# Altium schematic sheet MCU.SchDoc
size A3
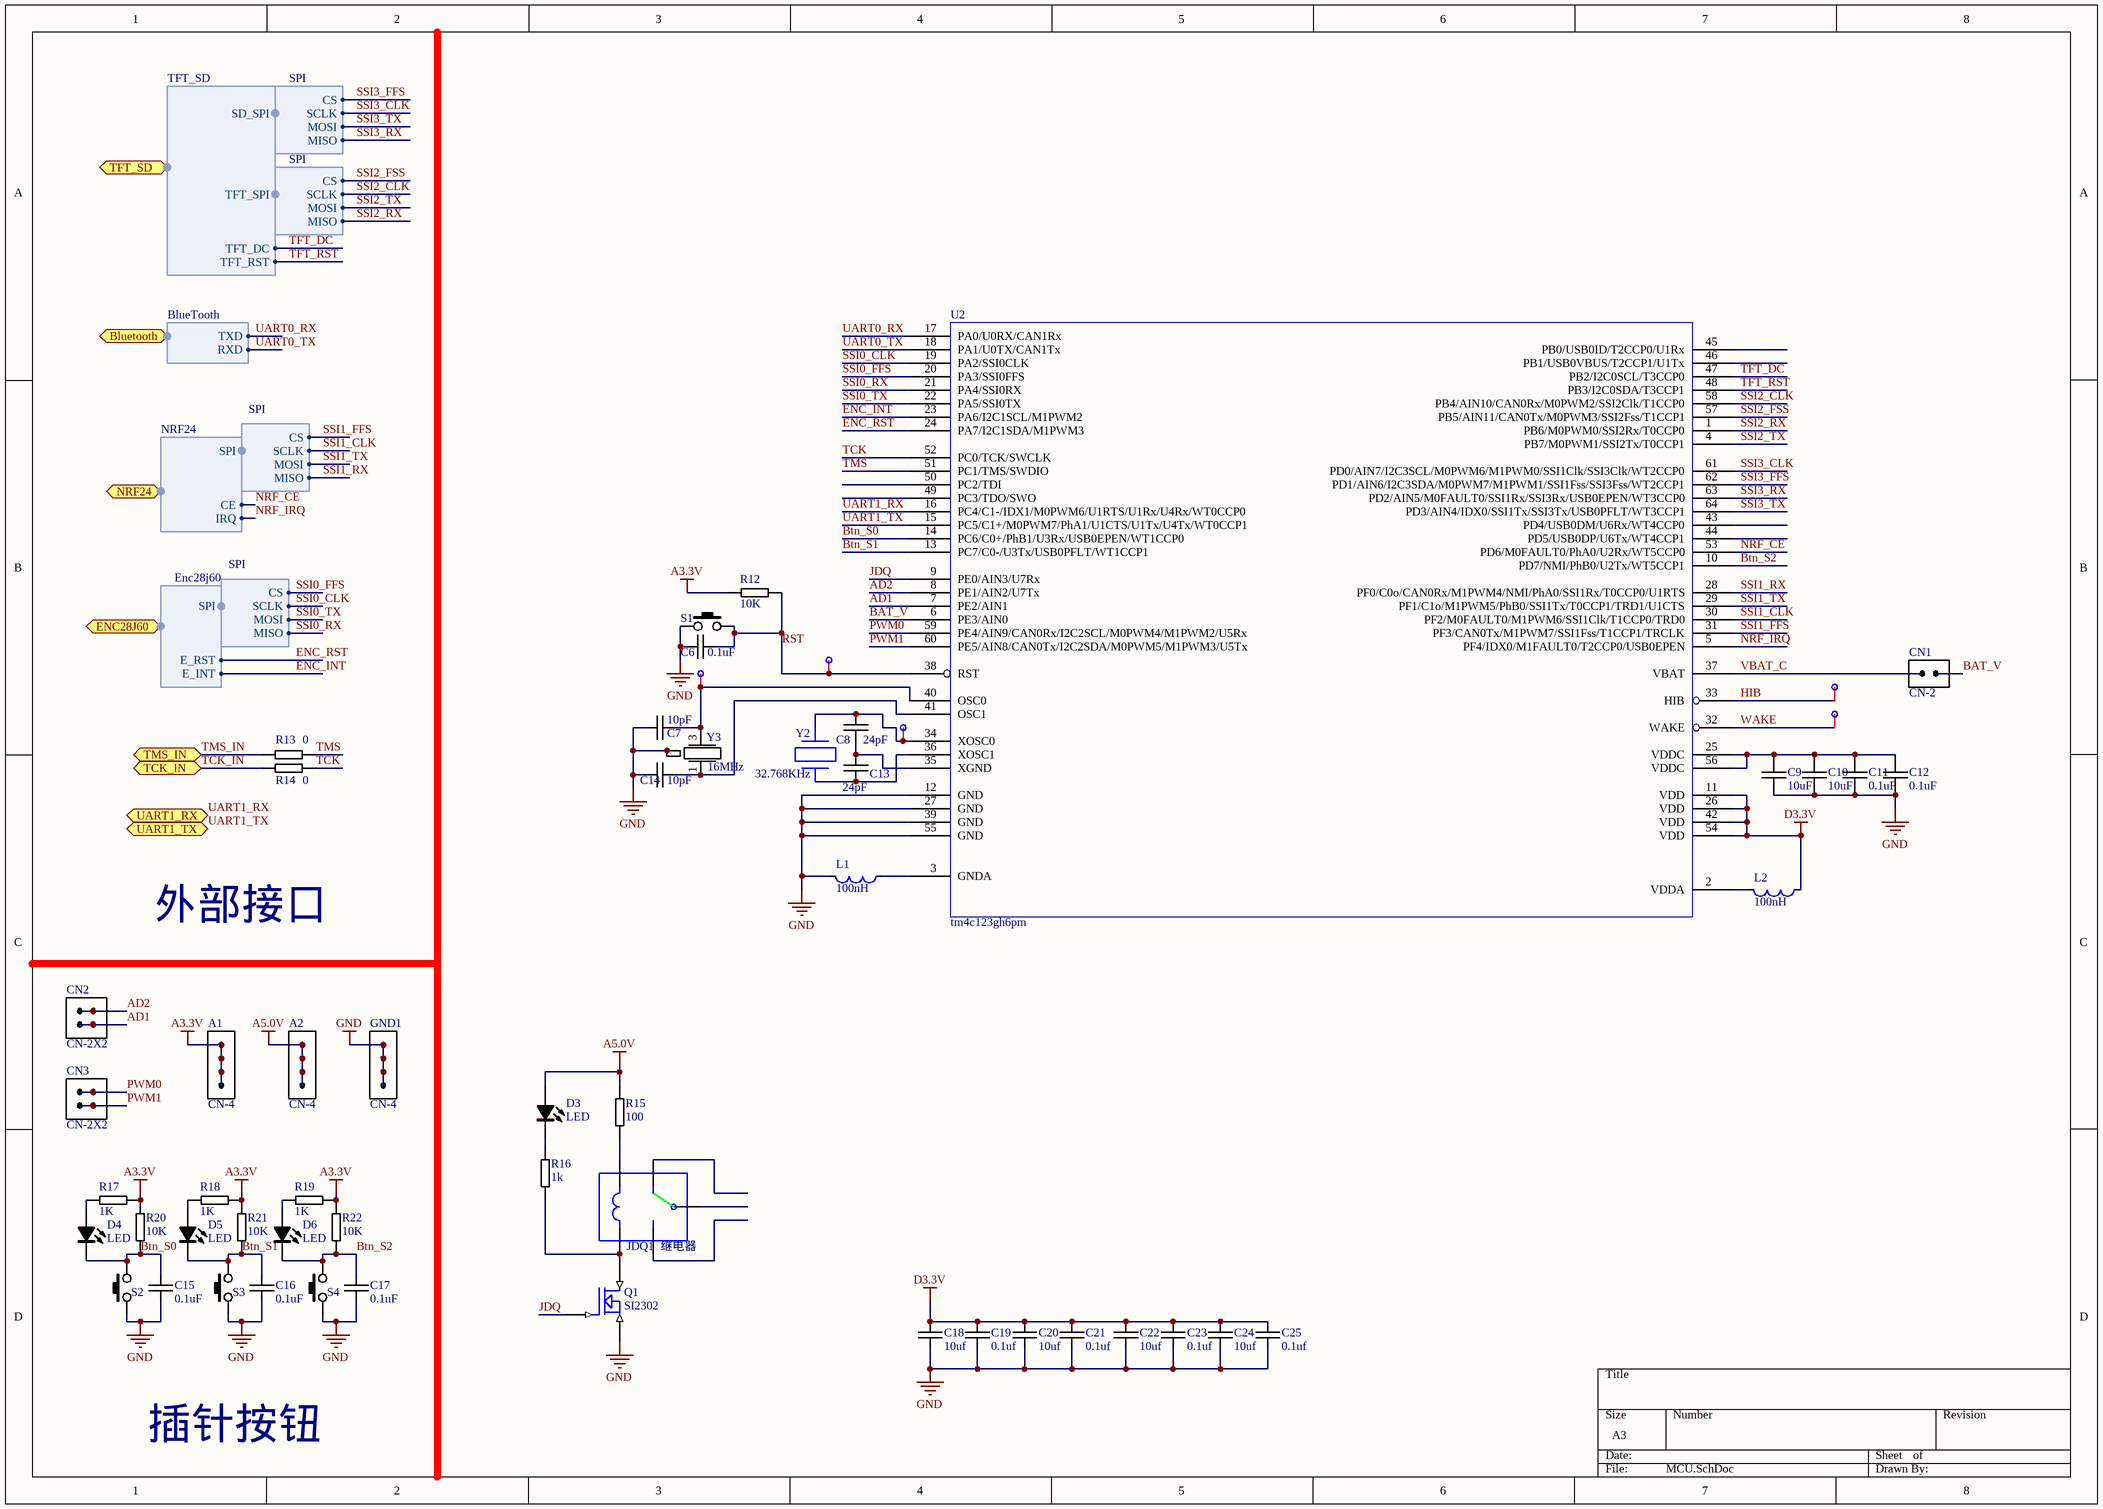
[diagram p0: MCU.SchDoc]

## Parts
A1  CN-4  [SIP-4]
A2  CN-4  [SIP-4]
C6  0.1uF  [0805-C]
C7  10pF  [0805-C]
C8  24pF  [0805-C]
C9  10uF  [0805-C]
C10  10uF  [0805-C]
C11  0.1uF  [0805-C]
C12  0.1uF  [0805-C]
C13  24pF  [0805-C]
C14  10pF  [0805-C]
C15  0.1uF  [0805-C]
C16  0.1uF  [0805-C]
C17  0.1uF  [0805-C]
C18  10uf  [0603]
C19  0.1uf  [0603]
C20  10uf  [0603]
C21  0.1uf  [0603]
C22  10uf  [0603]
C23  0.1uf  [0603]
C24  10uf  [0603]
C25  0.1uf  [0603]
CN1  CN-2  [SIP-2]
CN2  CN-2X2  [IDC-4]
CN3  CN-2X2  [IDC-4]
D3  LED  [0805-LED]
D4  LED  [0805-LED]
D5  LED  [0805-LED]
D6  LED  [0805-LED]
GND1  CN-4  [SIP-4]
JDQ1  继电器  [继电器]
L1  100nH  [0805]
L2  100nH  [0805]
P2  Point  [Point]  (value not drawn)
P3  Point  [Point]  (value not drawn)
P4  Point  [Point]  (value not drawn)
P5  Point  [Point]  (value not drawn)
P6  Point  [Point]  (value not drawn)
Q1  SI2302  [sot-23]
R12  10K  [0805-R]
R13  0  [0603]
R14  0  [0603]
R15  100  [0603]
R16  1k  [0805-R]
R17  1K  [0805-R]
R18  1K  [0805-R]
R19  1K  [0805-R]
R20  10K  [0805-R]
R21  10K  [0805-R]
R22  10K  [0805-R]
S1  KEY(轻触,6×6×4.3)  [轻触开关(3*6*2.5)]  (value not drawn)
S2  KEY(轻触,6×6×4.3)  [轻触开关(3*6*2.5)]  (value not drawn)
S3  KEY(轻触,6×6×4.3)  [轻触开关(3*6*2.5)]  (value not drawn)
S4  KEY(轻触,6×6×4.3)  [轻触开关(3*6*2.5)]  (value not drawn)
U2  tm4c123gh6pm  [LQFP64]
Y2  32.768KHz  [XTAL(Φ2×6)]
Y3  16MHz  [4脚晶振]

## Ports
Bluetooth (harness BlueTooth), ENC28J60 (harness Enc28j60), NRF24 (harness NRF24), TCK_IN, TFT_SD (harness TFT_SD), TMS_IN, UART1_RX, UART1_TX

## Harnesses
Enc28j60: SPI, E_RST, E_INT
SPI: CS, SCLK, MOSI, MISO
NRF24: SPI, CE, IRQ
BlueTooth: TXD, RXD
TFT_SD: SD_SPI, TFT_SPI, TFT_DC, TFT_RST

## Nets
A3.3V: A1.1 A1.2 A1.3 A1.4 R12.2 R17.2 R18.2 R19.2 R20.1 R21.1 R22.1
A5.0V: A2.1 A2.2 A2.3 A2.4 D3.1(A) R15.1
D3.3V: C18.1 C19.1 C20.1 C21.1 C22.1 C23.1 C24.1 C25.1 L2.2 U2.11(VDD) U2.26(VDD) U2.42(VDD) U2.54(VDD)
GND: C6.1 C7.1 C9.2 C10.2 C11.2 C12.2 C14.1 C15.1 C16.1 C17.1 C18.2 C19.2 C20.2 C21.2 C22.2 C23.2 C24.2 C25.2 GND1.1 GND1.2 GND1.3 GND1.4 L1.1 Q1.2(S) S1.1 S2.1 S3.1 S4.1 U2.12(GND) U2.27(GND) U2.39(GND) U2.55(GND) Y3.2(G) Y3.4(G)
AD1: CN2.3 CN2.4 U2.7(PE2/AIN1)
AD2: CN2.1 CN2.2 U2.8(PE1/AIN2/U7Tx)
BAT_V: CN1.2 U2.6(PE3/AIN0)
Btn_S0: C15.2 D4.2(K) R20.2 S2.2 U2.14(PC6/C0+/PhB1/U3Rx/USB0EPEN/WT1CCP0)
Btn_S1: C16.2 D5.2(K) R21.2 S3.2 U2.13(PC7/C0-/U3Tx/USB0PFLT/WT1CCP1)
Btn_S2: C17.2 D6.2(K) R22.2 S4.2 U2.10(PD7/NMI/PhB0/U2Tx/WT5CCP1)
ENC_INT: U2.23(PA6/I2C1SCL/M1PWM2) ; port ENC28J60.E_INT
ENC_RST: U2.24(PA7/I2C1SDA/M1PWM3) ; port ENC28J60.E_RST
HIB: P4.1(Point) U2.33(HIB)
JDQ: Q1.1(G) U2.9(PE0/AIN3/U7Rx)
NRF_CE: U2.53(PD6/M0FAULT0/PhA0/U2Rx/WT5CCP0) ; port NRF24.CE
NRF_IRQ: U2.5(PF4/IDX0/M1FAULT0/T2CCP0/USB0EPEN) ; port NRF24.IRQ
PWM0: CN3.1 CN3.2 U2.59(PE4/AIN9/CAN0Rx/I2C2SCL/M0PWM4/M1PWM2/U5Rx)
PWM1: CN3.3 CN3.4 U2.60(PE5/AIN8/CAN0Tx/I2C2SDA/M0PWM5/M1PWM3/U5Tx)
RST: C6.2 P2.1(Point) R12.1 S1.2 U2.38(RST)
SSI0_CLK: U2.19(PA2/SSI0CLK) ; harness SPI.SCLK
SSI0_FFS: U2.20(PA3/SSI0FFS) ; harness SPI.CS
SSI0_RX: U2.21(PA4/SSI0RX) ; harness SPI.MISO
SSI0_TX: U2.22(PA5/SSI0TX) ; harness SPI.MOSI
SSI1_CLK: U2.30(PF2/M0FAULT0/M1PWM6/SSI1Clk/T1CCP0/TRD0) ; harness SPI.SCLK
SSI1_FFS: U2.31(PF3/CAN0Tx/M1PWM7/SSI1Fss/T1CCP1/TRCLK) ; harness SPI.CS
SSI1_RX: U2.28(PF0/C0o/CAN0Rx/M1PWM4/NMI/PhA0/SSI1Rx/T0CCP0/U1RTS) ; harness SPI.MISO
SSI1_TX: U2.29(PF1/C1o/M1PWM5/PhB0/SSI1Tx/T0CCP1/TRD1/U1CTS) ; harness SPI.MOSI
SSI2_CLK: U2.58(PB4/AIN10/CAN0Rx/M0PWM2/SSI2Clk/T1CCP0) ; harness SPI.SCLK
SSI2_FSS: U2.57(PB5/AIN11/CAN0Tx/M0PWM3/SSI2Fss/T1CCP1) ; harness SPI.CS
SSI2_RX: U2.1(PB6/M0PWM0/SSI2Rx/T0CCP0) ; harness SPI.MISO
SSI2_TX: U2.4(PB7/M0PWM1/SSI2Tx/T0CCP1) ; harness SPI.MOSI
SSI3_CLK: U2.61(PD0/AIN7/I2C3SCL/M0PWM6/M1PWM0/SSI1Clk/SSI3Clk/WT2CCP0) ; harness SPI.SCLK
SSI3_FFS: U2.62(PD1/AIN6/I2C3SDA/M0PWM7/M1PWM1/SSI1Fss/SSI3Fss/WT2CCP1) ; harness SPI.CS
SSI3_RX: U2.63(PD2/AIN5/M0FAULT0/SSI1Rx/SSI3Rx/USB0EPEN/WT3CCP0) ; harness SPI.MISO
SSI3_TX: U2.64(PD3/AIN4/IDX0/SSI1Tx/SSI3Tx/USB0PFLT/WT3CCP1) ; harness SPI.MOSI
TCK: R14.2 U2.52(PC0/TCK/SWCLK)
TCK_IN: R14.1 ; port TCK_IN
TFT_DC: U2.47(PB2/I2C0SCL/T3CCP0) ; port TFT_SD.TFT_DC
TFT_RST: U2.48(PB3/I2C0SDA/T3CCP1) ; port TFT_SD.TFT_RST
TMS: R13.2 U2.51(PC1/TMS/SWDIO)
TMS_IN: R13.1 ; port TMS_IN
UART0_RX: U2.17(PA0/U0RX/CAN1Rx) ; port Bluetooth.TXD
UART0_TX: U2.18(PA1/U0TX/CAN1Tx) ; port Bluetooth.RXD
UART1_RX: U2.16(PC4/C1-/IDX1/M0PWM6/U1RTS/U1Rx/U4Rx/WT0CCP0) ; port UART1_RX
UART1_TX: U2.15(PC5/C1+/M0PWM7/PhA1/U1CTS/U1Tx/U4Tx/WT0CCP1) ; port UART1_TX
VBAT_C: CN1.1 U2.37(VBAT)
WAKE: P5.1(Point) U2.32(WAKE)
NetC7_2: C7.2 P3.1(Point) U2.40(OSC0) Y3.3(O)
NetC8_1: C8.1 P6.1(Point) U2.34(XOSC0) Y2.1
NetC8_2: C8.2 C13.1 U2.35(XGND)
NetC9_1: C9.1 C10.1 C11.1 C12.1 U2.25(VDDC) U2.56(VDDC)
NetC13_2: C13.2 U2.36(XOSC1) Y2.2
NetC14_2: C14.2 U2.41(OSC1) Y3.1(O)
NetD3_2: D3.2(K) R16.1
NetD4_1: D4.1(A) R17.1
NetD5_1: D5.1(A) R18.1
NetD6_1: D6.1(A) R19.1
NetJDQ1_2: JDQ1.2(I1) R15.2
NetJDQ1_5: JDQ1.5(I2) Q1.3(D) R16.2
NetL1_2: L1.2 U2.3(GNDA)
NetL2_1: L2.1 U2.2(VDDA)

Not connected (* = marked no-connect by the designer): JDQ1 1 3(5) 4; U2 43(PD4/USB0DM/U6Rx/WT4CCP0) 44(PD5/USB0DP/U6Tx/WT4CCP1) 45(PB0/USB0ID/T2CCP0/U1Rx) 46(PB1/USB0VBUS/T2CCP1/U1Tx) 49(PC3/TDO/SWO) 50(PC2/TDI)

## Notes on the sheet
- 外部接口
- 插针按钮

## Library data of the parts
C6-C25 = CAP_Chip: 贴片
D3-D6 = LED: 贴片
L1 L2 = L
R12-R22 = RES_Chip: 贴片
S1-S4 = KEY(轻触,6×6×4.3): 1.09.02.0001
Y2 = XTAL_32_768
Y3 = XTAL_16M